# EasyEDA Pro project KP1921VG015.epro

# Board PCB1
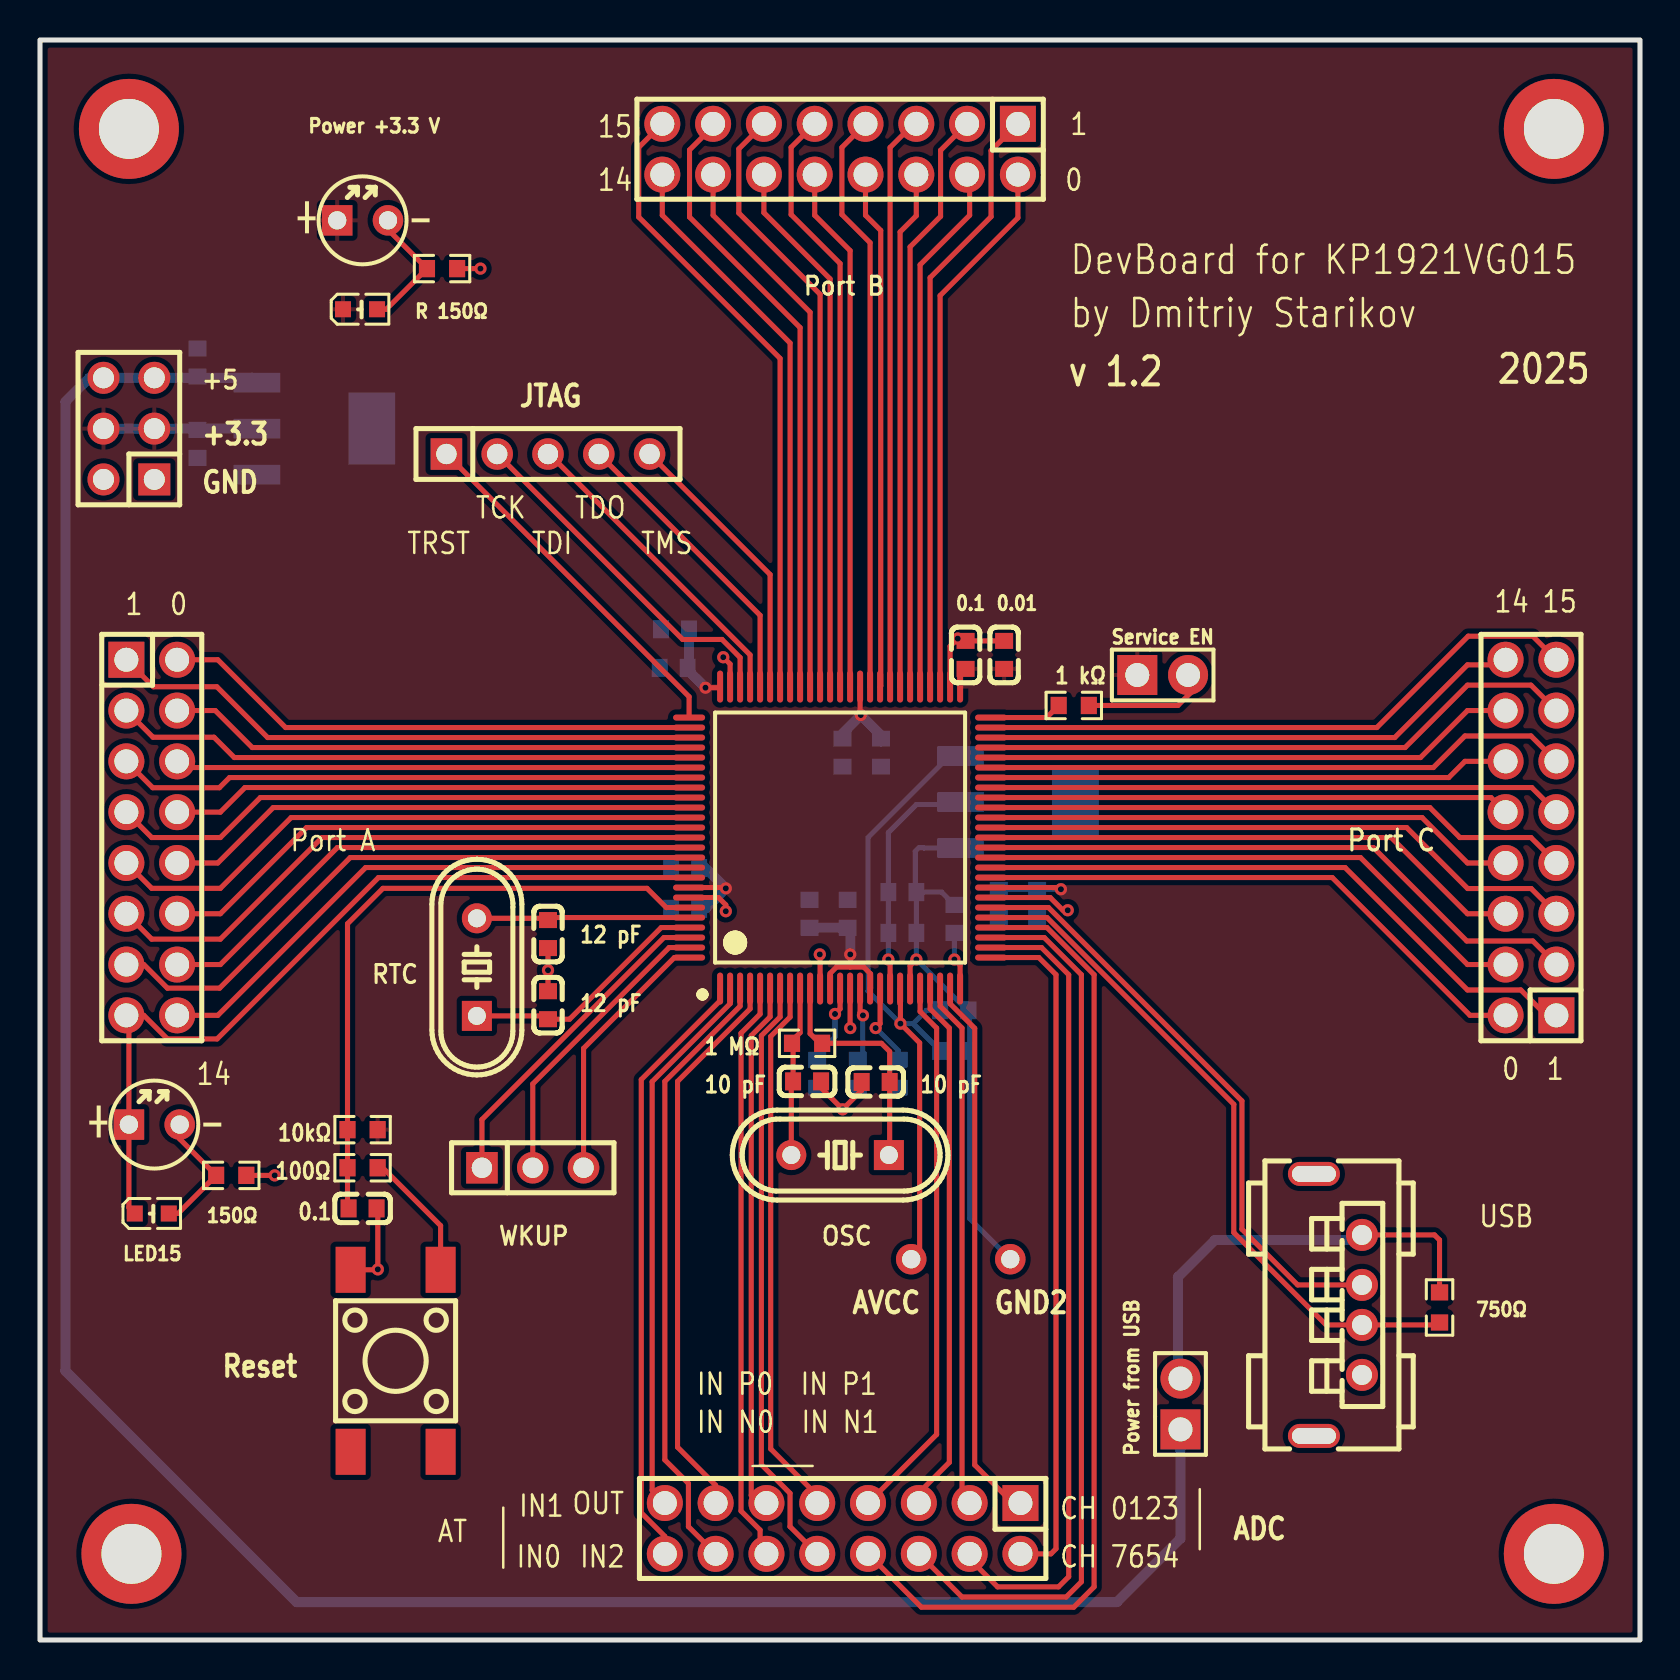
[diagram p0: board, top side]
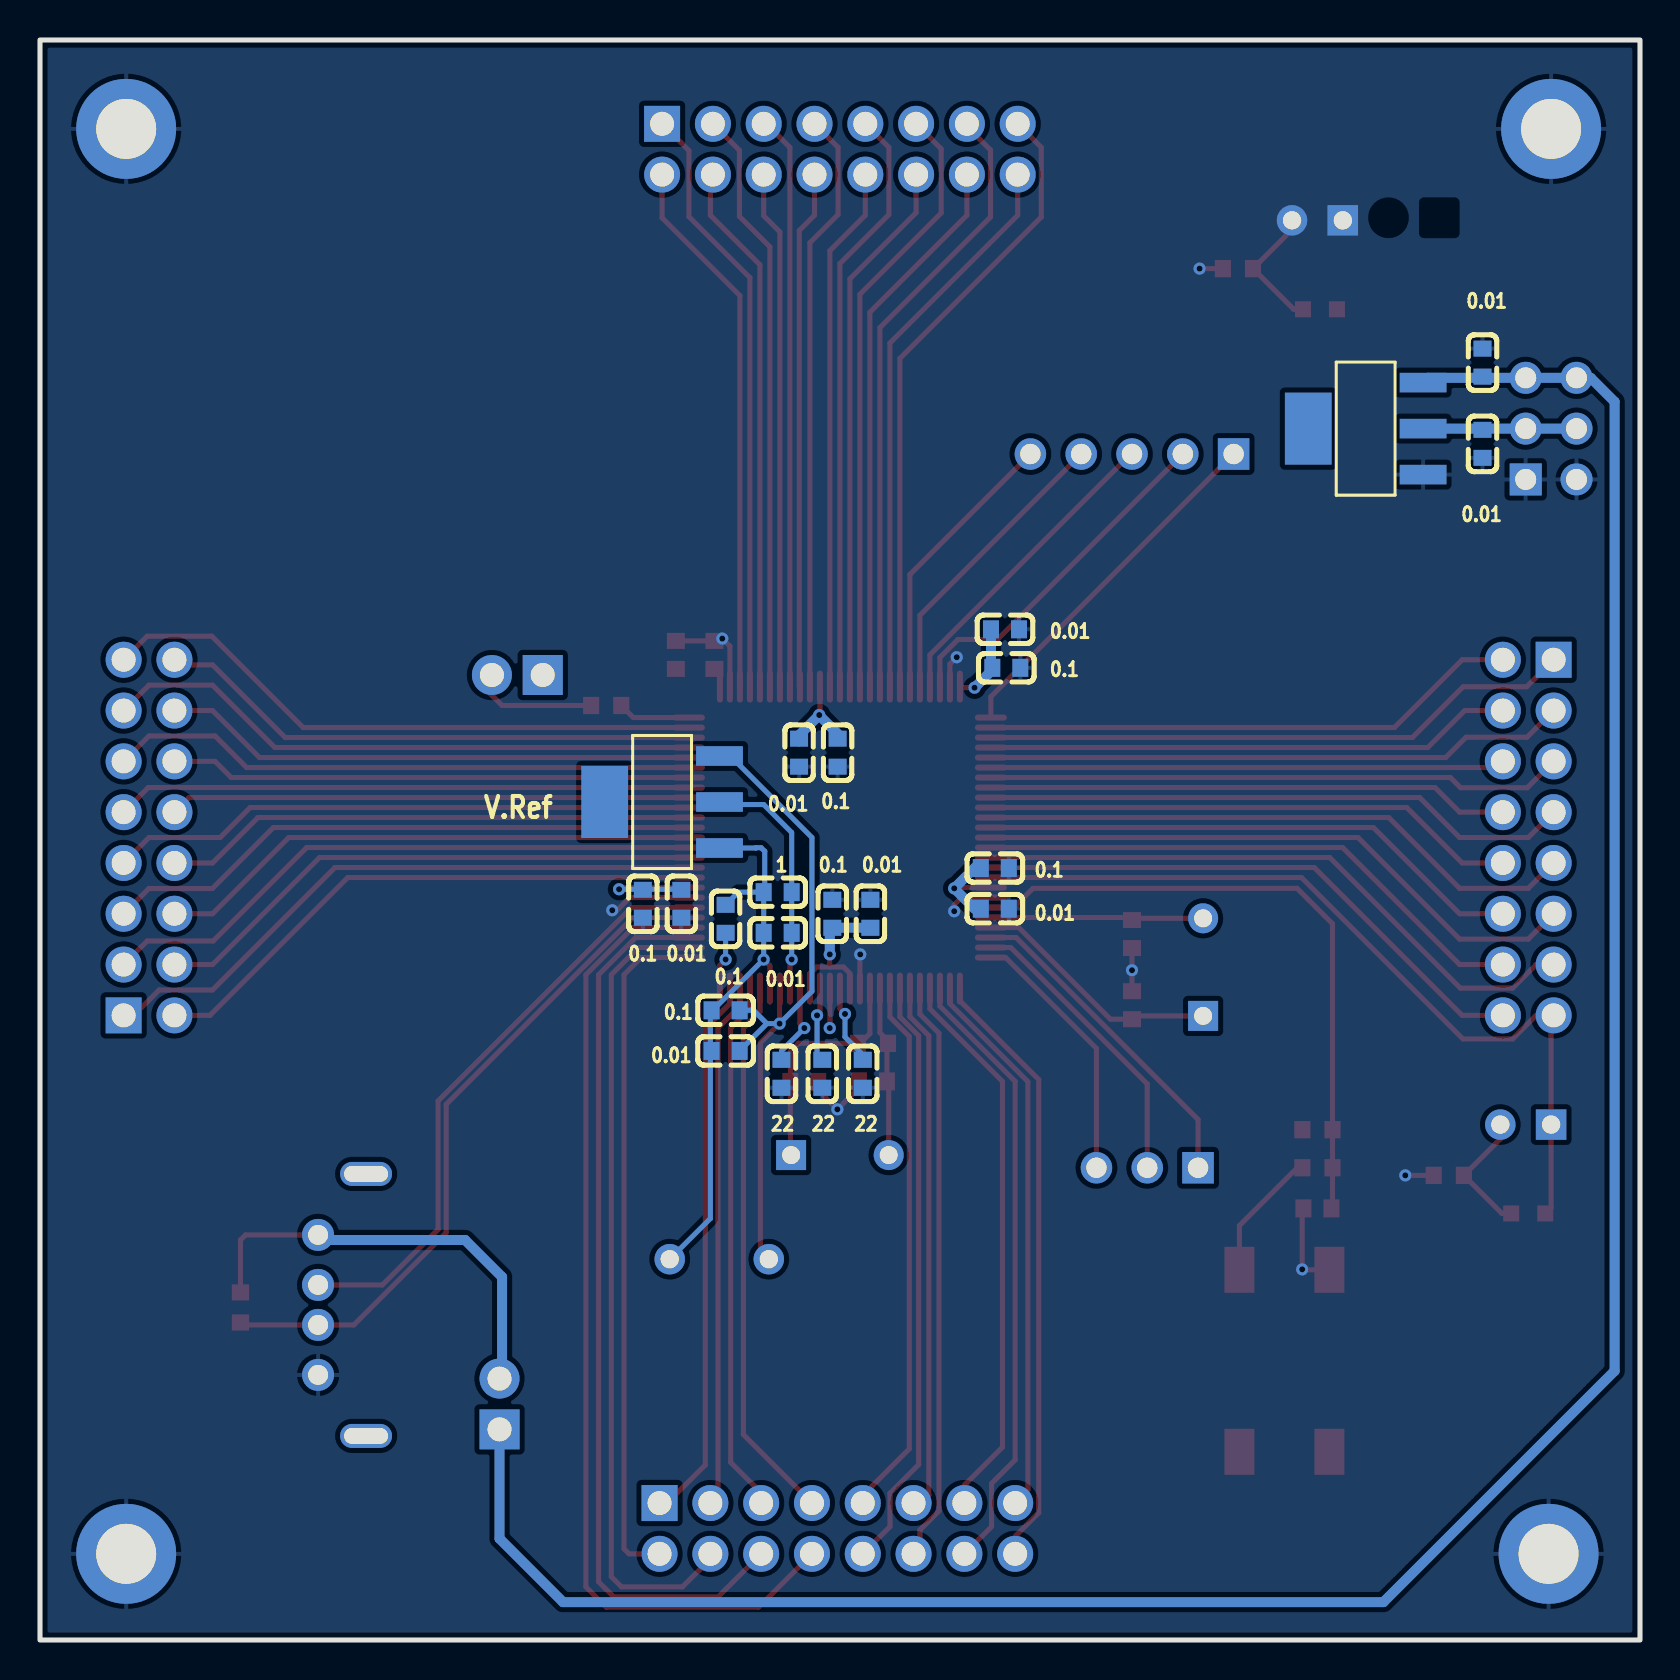
[diagram p1: board, bottom side, seen from below]

Outline 80 x 80 mm; copper layers: Top Layer, Bottom Layer. Coordinates in mm from the lower left corner of the outline.
Outline path: rectangle 0,80 80,0
Stack: Top Layer 0.035mm / Dielectric1 1.51mm FR4 er 4.5 / Bottom Layer 0.035mm

## Design rules (mm)
net USB_D+: DP1
net USB_D-: DP1
template: JLCPCB Capability(Two Layers Board)
spacing copperThickness1oz (default): track to track 0.102, other pairs 0.152 to 0.3
spacing copperThickness2oz: track to track 0.203, other pairs 0.152 to 0.3
track width copperThickness1oz (default): min 0.127, default 0.254, max 2.54
track width copperThickness2oz: min 0.203, default 0.254, max 2.54
differential pair differentialPair (default): width min 0.127, default 0.254, max 2.54; gap min 0.152, default 0.152
via viaSize (default): diameter min 0.5, default 0.61, max 10; hole min 0.3, default 0.305, max 6.3

## Placement (name value [footprint] x y rotation side)
150Ω  10K  [R0603]  9.56 23.23 0 top
 750Ω  10K  [R0603]  69.98 16.63 90 top
+5  -  [HDR-TH_6P-P2.54-V-R2-C3-S2.54_A2541WV-2X3P]  4.44 60.57 90 top
C1  100nF  [C0603]  38.86 28.31 90 bottom
C2  100nF  [C0603]  40.89 28.31 90 bottom
C3  100nF  [C0603]  42.93 28.31 90 bottom
C4  100nF  [C0603]  45.72 36.06 270 bottom
C5  -  [C0603]  46.28 49.26 270 top
C5#2  -  [C0603]  38.48 36.31 270 bottom
C5#3  -  [C0603]  49.86 36.81 90 bottom
C5#4  -  [C0603]  42.05 44.37 90 bottom
C5#5  -  [C0603]  31.75 50.54 0 bottom
C5#6  -  [C0603]  32.26 38.6 0 bottom
C6  -  [C0603]  48.21 49.26 270 top
C6#2  -  [C0603]  40.39 36.31 270 bottom
C6#3  -  [C0603]  47.93 36.81 90 bottom
C6#4  -  [C0603]  40.12 44.37 90 bottom
C6#5  -  [C0603]  31.69 48.61 0 bottom
C6#6  -  [C0603]  32.26 36.57 0 bottom
C7  100nF  [C0603]  7.87 63.87 90 bottom
C8  100nF  [C0603]  7.87 59.81 270 bottom
C9  100nF  [C0603]  16.13 21.58 0 top
C10  100nF  [C0603]  41.78 27.9 0 top
C11  100nF  [C0603]  38.35 27.93 180 top
C12  100nF  [C0603]  25.4 31.74 270 top
C13  100nF  [C0603]  25.4 35.3 90 top
C14  -  [C0603]  43.12 35.36 180 bottom
C14#2  -  [C0603]  45.72 29.45 180 bottom
C15  -  [C0603]  43.12 37.39 180 bottom
C15#2  -  [C0603]  45.72 31.49 180 bottom
H5  PZ254V-12-16P  [HDR-TH_16P-P2.54-V-M-R2-C8-S2.54]  40.13 5.58 180 top
H8  -  [HDR-TH_5P-P2.54-V-F]  25.4 59.3 0 top
LED15  TJ-L3FYTGHRMFCLFLC2R-A5  [LED-TH_BD3.9-P2.54-FD]  5.71 25.77 0 top
NOREF  -  [Pad_e4]  75.69 75.56 0 top
NOREF#2  -  [Pad_e2714]  43.56 19.04 0 top
NOREF#3  -  [Pad_e36]  4.57 4.31 0 top
NOREF#4  -  [Pad_e3375]  48.51 19.04 0 top
NOREF#5  -  [Pad_e37]  4.44 75.56 0 top
NOREF#6  -  [Pad_e33]  75.69 4.31 0 top
NOREF#7  -  [LED0603-R-RD]  5.59 21.33 0 top
NOREF#8  -  [LED0603-R-RD]  16 66.54 0 top
OSC  4MHz  [HC-49US_L11.5-W4.5-P4.88]  40 24.25 180 top
Port A  PZ254V-12-16P  [HDR-TH_16P-P2.54-V-M-R2-C8-S2.54]  5.59 40.12 270 top
Port B  PZ254V-12-16P  [HDR-TH_16P-P2.54-V-M-R2-C8-S2.54]  40 74.54 180 top
Port C  PZ254V-12-16P  [HDR-TH_16P-P2.54-V-M-R2-C8-S2.54]  74.55 40.12 90 top
Power +3.3 V  TJ-L3FYTGHRMFCLFLC2R-A5  [LED-TH_BD3.9-P2.54-FD]  16.13 70.98 0 top
Power from USB  PZ254V-11-02P  [HDR-TH_2P-P2.54-V-M]  57.02 11.8 90 top
R1  10K  [R0603]  51.69 46.73 0 top
R2  10K  [R0603]  16.13 23.61 180 top
R3  10K  [R0603]  16.13 25.52 0 top
R4  10K  [R0603]  38.35 29.84 180 top
R 150Ω  10K  [R0603]  20.1 68.57 0 top
Reset  -  [SW-SMD_4P-L6.0-W6.0-P4.50-LS9.0-2]  17.78 13.96 270 top
RTC  4MHz  [HC-49US_L11.5-W4.5-P4.88]  21.84 33.65 90 top
Service EN  PZ254V-11-02P  [HDR-TH_2P-P2.54-V-M]  56.13 48.25 0 top
USB1  AF 180°ZJB13.7  [USB-A-TH_AF-ZJB13.7]  64.9 16.75 270 top
V ADC  AMS1117-3.3  [SOT-223-3_L6.7-W3.7-P2.30-LS7.0-BR]  48.89 41.9 180 bottom
VIN  AMS1117-3.3  [SOT-223-3_L6.7-W3.7-P2.30-LS7.0-BR]  13.72 60.57 180 bottom
WKUP  -  [HDR-TH_3P-P2.54-V-F]  24.64 23.61 0 top
КР1921ВГ015  STM32L4A6VGT6  [LQFP-100_L14.0-W14.0-P0.50-LS16.0-BL]  40 40.12 0 top

## Footprints (pads in the part's own frame, mm; a bottom-side part is the same pattern mirrored in y, then rotated)
C0603
  rect 0.8x0.9 smd: 1(-0.7,0) 2(0.7,0)
HC-49US_L11.5-W4.5-P4.88
  rect 1.5x1.5 hole 0.9: 1(-2.44,0)
  round 1.5 hole 0.9: 2(2.44,0)
HDR-TH_2P-P2.54-V-M
  rect 2x2 hole 1.2: 1(-1.27,0)
  round 2 hole 1.2: 2(1.27,0)
HDR-TH_3P-P2.54-V-F
  rect 1.575x1.575 hole 1.02: 1(-2.54,0)
  round 1.575 hole 1.02: 2(0,0) 3(2.54,0)
HDR-TH_5P-P2.54-V-F
  rect 1.575x1.575 hole 1.02: 1(-5.08,0)
  round 1.575 hole 1.02: 2(-2.54,0) 3(0,0) 4(2.54,0) 5(5.08,0)
HDR-TH_6P-P2.54-V-R2-C3-S2.54_A2541WV-2X3P
  rect 1.6x1.6 hole 1.05: 1(-2.54,-1.27)
  round 1.6 hole 1.05: 2(-2.54,1.27) 3(0,-1.27) 4(0,1.27) 5(2.54,-1.27) 6(2.54,1.27)
HDR-TH_16P-P2.54-V-M-R2-C8-S2.54
  rect 1.8x1.8 hole 1.2: 1(-8.89,-1.27)
  round 1.8 hole 1.2: 2(-8.89,1.27) 3(-6.35,-1.27) 4(-6.35,1.27) 5(-3.81,-1.27) 6(-3.81,1.27) 7(-1.27,-1.27) 8(-1.27,1.27) 9(1.27,-1.27) 10(1.27,1.27) 11(3.81,-1.27) 12(3.81,1.27) 13(6.35,-1.27) 14(6.35,1.27) 15(8.89,-1.27) 16(8.89,1.27)
LED0603-R-RD
  rect 0.8x0.8 smd: 1(0.851,0) 2(-0.851,0)
LED-TH_BD3.9-P2.54-FD
  rect 1.524x1.524 hole 0.914: 1(-1.27,0)
  round 1.524 hole 0.914: 2(1.27,0)
LQFP-100_L14.0-W14.0-P0.50-LS16.0-BL
  oval 0.3x1.6 smd: 1(-6,-7.55) 2(-5.5,-7.55) 3(-5,-7.55) 4(-4.5,-7.55) 5(-4,-7.55) 6(-3.5,-7.55) 7(-3,-7.55) 8(-2.5,-7.55) 9(-2,-7.55) 10(-1.5,-7.55) 11(-1,-7.55) 12(-0.5,-7.55) 13(0,-7.55) 14(0.5,-7.55) 15(1,-7.55) 16(1.5,-7.55) 17(2,-7.55) 18(2.5,-7.55) 19(3,-7.55) 20(3.5,-7.55) 21(4,-7.55) 22(4.5,-7.55) 23(5,-7.55) 24(5.5,-7.55) 25(6,-7.55) 51(6,7.55) 52(5.5,7.55) 53(5,7.55) 54(4.5,7.55) 55(4,7.55) 56(3.5,7.55) 57(3,7.55) 58(2.5,7.55) 59(2,7.55) 60(1.5,7.55) 61(1,7.55) 62(0.5,7.55) 63(0,7.55) 64(-0.5,7.55) 65(-1,7.55) 66(-1.5,7.55) 67(-2,7.55) 68(-2.5,7.55) 69(-3,7.55) 70(-3.5,7.55) 71(-4,7.55) 72(-4.5,7.55) 73(-5,7.55) 74(-5.5,7.55) 75(-6,7.55)
  oval 1.6x0.3 smd: 26(7.55,-6) 27(7.55,-5.5) 28(7.55,-5) 29(7.55,-4.5) 30(7.55,-4) 31(7.55,-3.5) 32(7.55,-3) 33(7.55,-2.5) 34(7.55,-2) 35(7.55,-1.5) 36(7.55,-1) 37(7.55,-0.5) 38(7.55,0) 39(7.55,0.5) 40(7.55,1) 41(7.55,1.5) 42(7.55,2) 43(7.55,2.5) 44(7.55,3) 45(7.55,3.5) 46(7.55,4) 47(7.55,4.5) 48(7.55,5) 49(7.55,5.5) 50(7.55,6) 76(-7.55,6) 77(-7.55,5.5) 78(-7.55,5) 79(-7.55,4.5) 80(-7.55,4) 81(-7.55,3.5) 82(-7.55,3) 83(-7.55,2.5) 84(-7.55,2) 85(-7.55,1.5) 86(-7.55,1) 87(-7.55,0.5) 88(-7.55,0) 89(-7.55,-0.5) 90(-7.55,-1) 91(-7.55,-1.5) 92(-7.55,-2) 93(-7.55,-2.5) 94(-7.55,-3) 95(-7.55,-3.5) 96(-7.55,-4) 97(-7.55,-4.5) 98(-7.55,-5) 99(-7.55,-5.5) 100(-7.55,-6)
Pad_e4
  round 5 hole 3: 1(0,0)
Pad_e33
  round 5 hole 3: 1(0,0)
Pad_e36
  round 5 hole 3: 1(0,0)
Pad_e37
  round 5 hole 3: 1(0,0)
Pad_e2714
  round 1.524 hole 0.914: 1(0,0)
Pad_e3375
  round 1.524 hole 0.914: 1(0,0)
R0603
  rect 0.806x0.864 smd: 1(-0.753,0) 2(0.753,0)
SOT-223-3_L6.7-W3.7-P2.30-LS7.0-BR
  rect 2.34x0.98 smd: 1(2.87,-2.3) 2(2.87,0) 3(2.87,2.3)
  rect 2.34x3.6 smd: 4(-2.87,0)
SW-SMD_4P-L6.0-W6.0-P4.50-LS9.0-2
  rect 2.3x1.5 smd: 1(-4.55,2.25) 2(4.55,2.25) 3(-4.55,-2.25) 4(4.55,-2.25)
USB-A-TH_AF-ZJB13.7
  round 1.6 hole 1: 1(-3.5,1.2) 2(-1,1.2) 3(1,1.2) 4(3.5,1.2)
  oval 1.2x2.6 hole 0.8x2.2: 5(-6.55,-1.2) 5(6.55,-1.2)

## Nets
GND1: 150Ω.2 +5.1 +5.2 C1.1 C2.1 C3.1 C5.1 C5#2.1 C5#3.1 C5#4.1 C5#5.1 C5#6.1 C6.1 C6#2.1 C6#3.1 C6#4.1 C6#5.1 C6#6.1 C7.2 C8.2 C9.2 C10.1 C11.1 C12.1 C13.1 NOREF.1 NOREF#3.1 NOREF#5.1 NOREF#6.1 R 150Ω.2 Reset.3 USB1.4 VIN.1 КР1921ВГ015.11 КР1921ВГ015.32 КР1921ВГ015.52 КР1921ВГ015.74 КР1921ВГ015.94
GND2: C4.1 C14.1 C14#2.1 C15.1 C15#2.1 NOREF#4.1 V ADC.1 КР1921ВГ015.20
VCC1: +5.3 +5.4 C5.2 C5#2.2 C5#3.2 C5#4.2 C5#5.2 C5#6.2 C6.2 C6#2.2 C6#3.2 C6#4.2 C6#5.2 C6#6.2 C8.1 NOREF#8.2 Power +3.3 V.1 R3.2 Service EN.1 VIN.2 КР1921ВГ015.12 КР1921ВГ015.16 КР1921ВГ015.33 КР1921ВГ015.51 КР1921ВГ015.61 КР1921ВГ015.75 КР1921ВГ015.93
VCC2: C14#2.2 C15#2.2 NOREF#2.1 V ADC.3 КР1921ВГ015.19
VIN: +5.5 +5.6 C7.1 Power from USB.1 VIN.3
13: C1.2 КР1921ВГ015.13
15: C2.2 КР1921ВГ015.15
17: C3.2 КР1921ВГ015.17
$LED15_2: 150Ω.1 LED15.2 NOREF#7.1
$R1_2: R1.2 Service EN.2
$R2_1: R2.1 Reset.1
$R 150Ω_1: NOREF#8.1 Power +3.3 V.2 R 150Ω.1
ADC_CH0: H5.7 КР1921ВГ015.21
ADC_CH1: H5.5 КР1921ВГ015.22
ADC_CH2: H5.3 КР1921ВГ015.23
ADC_CH3: H5.1 КР1921ВГ015.24
ADC_CH4: H5.2 КР1921ВГ015.26
ADC_CH5: H5.4 КР1921ВГ015.27
ADC_CH6: H5.6 КР1921ВГ015.28
ADC_CH7: H5.8 КР1921ВГ015.29
AREF: C14.2 C15.2 V ADC.2 КР1921ВГ015.18
AT_IN0: H5.16 КР1921ВГ015.1
AT_IN1: H5.15 КР1921ВГ015.2
AT_IN2: H5.14 КР1921ВГ015.3
AT_OUT: H5.13 КР1921ВГ015.4
CNO_INN0: H5.12 КР1921ВГ015.5
CNO_INN1: H5.10 КР1921ВГ015.7
CNO_INP0: H5.11 КР1921ВГ015.6
CNO_INP1: H5.9 КР1921ВГ015.8
PA0: Port A.2 КР1921ВГ015.77
PA1: Port A.1 КР1921ВГ015.78
PA2: Port A.4 КР1921ВГ015.79
PA3: Port A.3 КР1921ВГ015.80
PA4: Port A.6 КР1921ВГ015.81
PA5: Port A.5 КР1921ВГ015.82
PA6: Port A.8 КР1921ВГ015.83
PA7: Port A.7 КР1921ВГ015.84
PA8: Port A.10 КР1921ВГ015.85
PA9: Port A.9 КР1921ВГ015.86
PA10: Port A.12 КР1921ВГ015.87
PA11: Port A.11 КР1921ВГ015.88
PA12: Port A.14 КР1921ВГ015.89
PA13: Port A.13 КР1921ВГ015.90
PA14: Port A.16 КР1921ВГ015.91
PA15: LED15.1 NOREF#7.2 Port A.15 КР1921ВГ015.92
PB0: Port B.2 КР1921ВГ015.53
PB1: Port B.1 КР1921ВГ015.54
PB2: Port B.4 КР1921ВГ015.55
PB3: Port B.3 КР1921ВГ015.56
PB4: Port B.6 КР1921ВГ015.57
PB5: Port B.5 КР1921ВГ015.58
PB6: Port B.8 КР1921ВГ015.59
PB7: Port B.7 КР1921ВГ015.60
PB8: Port B.10 КР1921ВГ015.62
PB9: Port B.9 КР1921ВГ015.63
PB10: Port B.12 КР1921ВГ015.64
PB11: Port B.11 КР1921ВГ015.65
PB12: Port B.14 КР1921ВГ015.66
PB13: Port B.13 КР1921ВГ015.67
PB14: Port B.16 КР1921ВГ015.68
PB15: Port B.15 КР1921ВГ015.69
PC0: Port C.2 КР1921ВГ015.34
PC1: Port C.1 КР1921ВГ015.35
PC2: Port C.4 КР1921ВГ015.36
PC3: Port C.3 КР1921ВГ015.37
PC4: Port C.6 КР1921ВГ015.38
PC5: Port C.5 КР1921ВГ015.39
PC6: Port C.8 КР1921ВГ015.40
PC7: Port C.7 КР1921ВГ015.41
PC8: Port C.10 КР1921ВГ015.42
PC9: Port C.9 КР1921ВГ015.43
PC10: Port C.12 КР1921ВГ015.44
PC11: Port C.11 КР1921ВГ015.45
PC12: Port C.14 КР1921ВГ015.46
PC13: Port C.13 КР1921ВГ015.47
PC14: Port C.16 КР1921ВГ015.48
PC15: Port C.15 КР1921ВГ015.49
RST: C9.1 R2.2 R3.1 КР1921ВГ015.95
SDADC_CAP: C4.2 КР1921ВГ015.25
SERV_EN: R1.1 КР1921ВГ015.50
TCK: H8.2 КР1921ВГ015.73
TDI: H8.3 КР1921ВГ015.72
TDO: H8.4 КР1921ВГ015.71
TMS: H8.5 КР1921ВГ015.70
TRST: H8.1 КР1921ВГ015.76
USB_D+:  750Ω.1 USB1.3 КР1921ВГ015.30
USB_D-: USB1.2 КР1921ВГ015.31
V_BAT: КР1921ВГ015.14
VUSB:  750Ω.2 Power from USB.2 USB1.1
WKUP0: WKUP.3 КР1921ВГ015.100
WKUP1: WKUP.2 КР1921ВГ015.99
WKUP2: WKUP.1 КР1921ВГ015.98
XI_OSC: C11.2 OSC.2 R4.2 КР1921ВГ015.9
XI_RTC: C12.2 RTC.1 КР1921ВГ015.97
XO_OSC: C10.2 OSC.1 R4.1 КР1921ВГ015.10
XO_RTC: C13.2 RTC.2 КР1921ВГ015.96

Pads without a net: Reset 2 4; USB1 5; V ADC 4; VIN 4

## Via types
v1: diameter 0.61, hole 0.305, Top Layer to Bottom Layer, 23 vias

## Routing (per net, layer and track width the routed paths; a pad name or vN(x,y) marks a point on that pad's centre or on a via; arc(x,y) is an arc through that point)
GND1: length 27
  Top Layer w0.254: C9.2 16.89,21.52 v1(16.89,18.53) 16.87,18.51 Reset.3 ; v1(34.16,49.14) 34.5,48.8 КР1921ВГ015.74 ; 150Ω.2 v1(11.73,23.23) ; v1(51.39,36.49) 51.15,36.49 50.51,37.12 КР1921ВГ015.32 ; КР1921ВГ015.52 45.5,49.69 v1(45.89,50.07) ; C13.1 25.4,33.49 ; v1(34.29,36.44) 34.29,36.76 33.92,37.12 КР1921ВГ015.94 ; C6.1 C5.1 ; КР1921ВГ015.11 39,34.26 v1(38.99,34.28) ; C11.1 39.05,27.61 v1(40.13,26.53) 41.08,27.48 C10.1 ; C12.1 v1(25.4,33.49) ; 20.86,68.57 v1(22.02,68.57)
GND2: length 28.5
  Top Layer w0.254: v1(43.82,34.03) 43.5,33.71 КР1921ВГ015.20
  Bottom Layer w0.254: C15.1 C14.1 43.82,34.03 v1(43.82,34.03) 46.48,31.36 46.48,21.07 NOREF#4.1 ; C15.1 45.09,37.39 C4.1 ; C15.1 43.76,37.45 43.76,39.43 43.94,39.61 44.2,39.61 44.21,39.6 V ADC.1
VCC1: length 35.8
  Top Layer w0.254: v1(41.04,46.25) 41,46.28 КР1921ВГ015.61 ; КР1921ВГ015.12 39.5,33.33 39.83,33.65 40.51,33.65 ; 40.51,33.65 40.51,33.66 v1(40.51,34.28) ; 40.51,33.65 41.18,33.65 41.53,33.31 41.53,32.6 КР1921ВГ015.16 ; v1(33.27,47.62) 33.95,47.62 КР1921ВГ015.75 ; КР1921ВГ015.93 34.25,37.62 v1(34.29,37.58) ; КР1921ВГ015.33 50.96,37.62 v1(51.05,37.54)
  Bottom Layer w0.254: C6#3.2 47.96,37.54 v1(51.05,37.54)
  Bottom Layer w0.5: C5#2.2 C6#2.2 40.51,35.49 v1(40.51,34.28) ; VIN.2 +5.3 +5.4 ; v1(33.27,47.62) 32.38,48.5 C6#5.2 32.45,48.67 C5#5.2 ; 40.13,45.33 41.04,46.24 v1(41.04,46.25) 42.05,45.24 42.05,44.94 ; C6#6.2 33.27,36.57 v1(34.29,37.58) 33.15,38.73
VCC2: length 35
  Top Layer w0.254: КР1921ВГ015.19 43,31.82 43.02,31.8 v1(43.02,30.82) 43.98,29.86 43.98,19.46 43.5,18.98 ; 43.5,18.98 43.56,18.91 43.43,18.91 43.5,18.98
  Bottom Layer w0.254: 43.66,30.82 v1(43.02,30.82) 41.4,32.44 41.4,40.12 45.48,44.2 V ADC.3 ; 43.66,30.82 44.32,31.49 C15#2.2 ; 43.66,30.82 C14#2.2
VIN: length 125.9
  Bottom Layer w0.5: Power from USB.1 57.02,5.07 53.85,1.9 12.83,1.9 1.27,13.45 1.27,61.91 2.47,63.11 +5.6 +5.5 10.61,63.11 VIN.3
13: length 4.1
  Top Layer w0.254: v1(39.75,31.3) 40,31.56 КР1921ВГ015.13
  Bottom Layer w0.254: 38.61,29.01 39.75,30.15 v1(39.75,31.3)
15: length 3.7
  Top Layer w0.254: v1(41.15,31.23) 41,31.38 КР1921ВГ015.15
  Bottom Layer w0.254: C2.2 41.15,29.27 v1(41.15,31.23)
17: length 4.1
  Top Layer w0.254: v1(41.78,30.6) 42,30.82 КР1921ВГ015.17
  Bottom Layer w0.254: v1(41.78,30.6) 42.93,29.45 C3.2
$LED15_2: length 6.5
  Top Layer w0.254: NOREF#7.1 6.9,21.33 150Ω.1 6.98,25.05 LED15.2
$R1_2: length 6.3
  Top Layer w0.254: Service EN.2 57.53,48.12 57.53,47.36 56.9,46.73 R1.2
$R2_1: length 6.3
  Top Layer w0.254: 17.14,23.61 20.03,20.72 Reset.1
$R 150Ω_1: length 6.6
  Top Layer w0.254: Power +3.3 V.2 17.4,70.52 R 150Ω.1 17.32,66.54 NOREF#8.1
ADC_CH0: length 27.5
  Top Layer w0.254: КР1921ВГ015.21 44,31.42 44.83,30.6 44.83,10.28 41.4,6.85
ADC_CH1: length 26.8
  Top Layer w0.254: КР1921ВГ015.22 44.5,31.56 45.47,30.6 45.47,8.88 43.94,7.36 H5.5
ADC_CH2: length 26.3
  Top Layer w0.254: H5.3 46.1,7.23 46.1,30.6 45,31.69 КР1921ВГ015.23
ADC_CH3: length 27.4
  Top Layer w0.254: H5.1 48.64,6.85 46.74,8.75 46.74,30.58 45.5,31.82 КР1921ВГ015.24
ADC_CH4: length 34.2
  Top Layer w0.254: H5.2 50.55,4.31 50.8,4.56 50.8,33.26 49.94,34.12 КР1921ВГ015.26
ADC_CH5: length 40.5
  Top Layer w0.254: КР1921ВГ015.27 50.08,34.62 51.44,33.26 51.44,3.17 50.93,2.66 47.88,2.66 46.48,4.05 H5.4
ADC_CH6: length 45
  Top Layer w0.254: H5.6 46.1,2.15 51.31,2.15 52.07,2.91 52.07,33.26 50.21,35.12 КР1921ВГ015.28
ADC_CH7: length 49.6
  Top Layer w0.254: 41.4,4.31 44.07,1.64 51.69,1.64 52.7,2.66 52.7,33.26 50.35,35.62 КР1921ВГ015.29
AREF: length 12.1
  Top Layer w0.254: КР1921ВГ015.18 42.5,33.94 v1(42.42,34.03)
  Bottom Layer w0.254: 42.42,34.03 C14.2 C15.2 42.42,40.37 43.81,41.77 45.9,41.77 V ADC.2
AT_IN0: length 30.4
  Top Layer w0.254: 31.24,4.31 31.24,5.18 30.06,6.36 30.06,28.02 34,31.96 КР1921ВГ015.1
AT_IN1: length 27.6
  Top Layer w0.254: КР1921ВГ015.2 34.5,31.82 30.61,27.92 30.61,7.48 31.24,6.85
AT_IN2: length 30.9
  Top Layer w0.254: 33.78,4.31 32.42,5.67 32.42,7.83 31.24,9.01 31.24,27.93 35,31.69 КР1921ВГ015.3
AT_OUT: length 28
  Top Layer w0.254: КР1921ВГ015.4 35.5,31.56 31.88,27.93 31.88,9.64 33.78,7.74 33.78,6.85
CNO_INN0: length 29.2
  Top Layer w0.254: H5.12 36,4.62 36,5.5 35.05,6.45 35.05,30.34 36,31.3 КР1921ВГ015.5
CNO_INN1: length 29.8
  Top Layer w0.254: H5.10 37.5,5.67 37.5,7.34 36.07,8.77 36.07,30.22 37,31.15 КР1921ВГ015.7
CNO_INP0: length 26.7
  Top Layer w0.254: H5.11 35.94,6.85 35.56,7.23 35.56,30.22 36.5,31.16 КР1921ВГ015.6
CNO_INP1: length 27.1
  Top Layer w0.254: H5.9 38.86,7.23 36.54,9.56 36.54,30.18 37.5,31.15 КР1921ВГ015.8
PA0: length 27
  Top Layer w0.254: КР1921ВГ015.77 12.28,45.62 8.89,49.01 Port A.2
PA1: length 29.7
  Top Layer w0.254: Port A.1 5.67,47.66 8.84,47.66 11.38,45.12 КР1921ВГ015.78
PA2: length 26.4
  Top Layer w0.254: Port A.4 8.76,46.47 10.61,44.62 КР1921ВГ015.79
PA3: length 29.1
  Top Layer w0.254: КР1921ВГ015.80 9.72,44.12 8.7,45.14 5.65,45.14 Port A.3
PA4: length 25.7
  Top Layer w0.254: КР1921ВГ015.81 7.17,43.62 Port A.6
PA5: length 28.9
  Top Layer w0.254: Port A.5 5.64,42.61 8.97,42.61 9.48,43.12 КР1921ВГ015.82
PA6: length 26.1
  Top Layer w0.254: КР1921ВГ015.83 10.25,42.62 9.02,41.39 Port A.8
PA7: length 29.5
  Top Layer w0.254: КР1921ВГ015.84 11.02,42.12 9.02,40.12 5.59,40.12 Port A.7
PA8: length 26.7
  Top Layer w0.254: КР1921ВГ015.85 11.66,41.62 8.89,38.85 Port A.10
PA9: length 30.1
  Top Layer w0.254: КР1921ВГ015.86 12.56,41.12 9.02,37.58 5.59,37.58 Port A.9
PA10: length 27.4
  Top Layer w0.254: КР1921ВГ015.87 13.33,40.62 9.02,36.31 Port A.12
PA11: length 30.8
  Top Layer w0.254: КР1921ВГ015.88 14.1,40.12 9.02,35.04 5.59,35.04 Port A.11
PA12: length 28
  Top Layer w0.254: КР1921ВГ015.89 14.87,39.62 9.02,33.77 Port A.14
PA13: length 31.3
  Top Layer w0.254: Port A.13 5.19,33.77 6.37,32.59 8.98,32.59 15.51,39.12 КР1921ВГ015.90
PA14: length 28.7
  Top Layer w0.254: Port A.16 8.89,31.23 16.28,38.62 КР1921ВГ015.91
PA15: length 42
  Top Layer w0.254: КР1921ВГ015.92 16.92,38.12 8.85,30.05 6.37,30.05 5.19,31.23 Port A.15 4.44,31.11 LED15.1 4.44,21.62 NOREF#7.2
PB0: length 27.2
  Top Layer w0.254: Port B.2 48.89,71.11 45,67.22 КР1921ВГ015.53
PB1: length 30
  Top Layer w0.254: Port B.1 47.55,74.47 47.55,71.17 44.5,68.12 КР1921ВГ015.54
PB2: length 26.7
  Top Layer w0.254: Port B.4 46.48,73.14 46.48,71.24 44,68.76 КР1921ВГ015.55
PB3: length 29.3
  Top Layer w0.254: КР1921ВГ015.56 43.5,69.66 45.03,71.18 45.03,74.48 Port B.3
PB4: length 25.9
  Top Layer w0.254: Port B.6 43.81,71.21 43,70.4 КР1921ВГ015.57
PB5: length 28.8
  Top Layer w0.254: Port B.5 43.69,75.81 42.5,74.63 КР1921ВГ015.58
PB6: length 25.9
  Top Layer w0.254: Port B.8 41.28,71.24 42.04,70.48 42.04,47.7 КР1921ВГ015.59
PB7: length 29.2
  Top Layer w0.254: Port B.7 40.1,74.63 40.1,71.27 41.5,69.86 КР1921ВГ015.60
PB8: length 26.3
  Top Layer w0.254: Port B.10 38.73,71.24 40.5,69.47 КР1921ВГ015.62
PB9: length 29.6
  Top Layer w0.254: Port B.9 37.56,74.63 37.56,71.27 40,68.82 КР1921ВГ015.63
PB10: length 27
  Top Layer w0.254: Port B.12 36.19,71.36 39.5,68.05 КР1921ВГ015.64
PB11: length 30.3
  Top Layer w0.254: КР1921ВГ015.65 39,67.28 34.94,71.35 34.94,74.56 Port B.11
PB12: length 27.6
  Top Layer w0.254: Port B.14 33.66,71.24 38.5,66.39 КР1921ВГ015.66
PB13: length 30.9
  Top Layer w0.254: КР1921ВГ015.67 38,65.62 32.48,71.15 32.48,74.5 33.66,75.68 Port B.13
PB14: length 28.2
  Top Layer w0.254: Port B.16 31.12,71.24 37.5,64.85 КР1921ВГ015.68
PB15: length 31.6
  Top Layer w0.254: КР1921ВГ015.69 37,64.08 29.94,71.15 29.94,74.63 Port B.15
PC0: length 28.6
  Top Layer w0.254: Port C.2 71.5,31.23 64.61,38.12 КР1921ВГ015.34
PC1: length 31.3
  Top Layer w0.254: Port C.1 75.31,31.23 74.04,32.5 71.37,32.5 65.25,38.62 КР1921ВГ015.35
PC2: length 27.9
  Top Layer w0.254: Port C.4 71.37,33.77 66.02,39.12 КР1921ВГ015.36
PC3: length 30.7
  Top Layer w0.254: Port C.3 74.64,34.95 71.34,34.95 66.67,39.62 КР1921ВГ015.37
PC4: length 27.3
  Top Layer w0.254: Port C.6 71.37,36.31 67.56,40.12 КР1921ВГ015.38
PC5: length 30
  Top Layer w0.254: КР1921ВГ015.39 68.33,40.62 71.38,37.57 74.56,37.57 Port C.5
PC6: length 26.7
  Top Layer w0.254: Port C.8 71.37,38.85 69.1,41.12 КР1921ВГ015.40
PC7: length 29.4
  Top Layer w0.254: Port C.7 74.55,40.12 70.99,40.12 69.49,41.62 КР1921ВГ015.41
PC8: length 26
  Top Layer w0.254: Port C.10 72.55,42.12 КР1921ВГ015.42
PC9: length 28.8
  Top Layer w0.254: Port C.9 74.59,42.62 КР1921ВГ015.43
PC10: length 26.1
  Top Layer w0.254: КР1921ВГ015.44 70.44,43.12 71.25,43.93 Port C.12
PC11: length 29.4
  Top Layer w0.254: Port C.11 74.55,45.2 71.25,45.2 69.67,43.62 КР1921ВГ015.45
PC12: length 26.7
  Top Layer w0.254: КР1921ВГ015.46 69.02,44.12 71.37,46.47 Port C.14
PC13: length 30.1
  Top Layer w0.254: КР1921ВГ015.47 68.25,44.62 71.37,47.74 74.55,47.74 Port C.13
PC14: length 27.3
  Top Layer w0.254: Port C.16 73.03,48.76 71.37,48.76 67.74,45.12 КР1921ВГ015.48
PC15: length 30.6
  Top Layer w0.254: КР1921ВГ015.49 66.84,45.62 71.41,50.19 74.64,50.19 Port C.15
RST: length 32.6
  Top Layer w0.254: КР1921ВГ015.95 31.31,36.62 30.35,37.58 17.14,37.58 15.38,35.81 R3.1 R2.2 15.38,21.45
SDADC_CAP: length 2.9
  Top Layer w0.254: v1(45.72,34.03) 46,33.74 КР1921ВГ015.25
  Bottom Layer w0.254: v1(45.72,34.03) C4.2
SERV_EN: length 3.6
  Top Layer w0.254: КР1921ВГ015.50 50.33,46.12 R1.1
TCK: length 17.8
  Top Layer w0.254: КР1921ВГ015.73 35,49.12 34.1,50.03 32.13,50.03 H8.2
TDI: length 15.8
  Top Layer w0.254: КР1921ВГ015.72 35.5,49.25 25.59,59.17 25.53,59.17 H8.3
TDO: length 15
  Top Layer w0.254: КР1921ВГ015.71 36,51.23 H8.4
TMS: length 14.1
  Top Layer w0.254: КР1921ВГ015.70 36.5,53.27 H8.5
TRST: length 18.2
  Top Layer w0.254: H8.1 32.45,47.16 КР1921ВГ015.76
USB_D+: length 34.7
  Top Layer w0.254:  750Ω.1 69.86,15.75 USB1.3 64.31,15.75 59.69,20.37 59.69,26.78 50.35,36.12 КР1921ВГ015.30
USB_D-: length 30.1
  Top Layer w0.254: КР1921ВГ015.31 50.43,36.62 60.1,26.95 60.1,20.54 62.88,17.75 USB1.2
V_BAT: length 2
  Top Layer w0.254: КР1921ВГ015.14 40.5,30.61 v1(40.51,30.6)
VUSB: length 21.6
  Top Layer w0.254: USB1.1 69.72,20.25 69.98,20 69.98,17.59
  Bottom Layer w0.5: USB1.1 65.84,20 58.75,20 56.9,18.15 56.9,13.2 Power from USB.2
WKUP0: length 13.1
  Top Layer w0.254: WKUP.3 27.18,29.58 31.72,34.12 КР1921ВГ015.100
WKUP1: length 14.8
  Top Layer w0.254: КР1921ВГ015.99 31.46,34.62 24.64,27.8 WKUP.2
WKUP2: length 16.5
  Top Layer w0.254: КР1921ВГ015.98 31.19,35.12 22.1,26.03 22.1,23.61
XI_OSC: length 8.6
  Top Layer w0.254: КР1921ВГ015.9 38,30.37 37.6,29.96 37.65,29.91 C11.2 37.56,27.84 OSC.2
XI_RTC: length 12.6
  Top Layer w0.254: КР1921ВГ015.97 31.06,35.62 26.48,31.04 C12.2 25.23,31.21 RTC.1
XO_OSC: length 11.8
  Top Layer w0.254: OSC.1 42.48,24.29 C10.2 42.48,29.43 42.07,29.84 38.99,29.84 38.5,30.32 КР1921ВГ015.10
XO_RTC: length 10.7
  Top Layer w0.254: RTC.2 25.31,36.09 C13.2 25.53,36.12 КР1921ВГ015.96

## Copper pours and planes (outline as drawn; the poured copper is in the pictures)
GND1 on Bottom Layer: 0.38,79.62 79.63,79.62 79.63,0.37 0.38,0.37
VCC1 on Top Layer: 0.38,79.62 79.63,79.62 79.63,0.37 0.38,0.37

## Text on the board
Bottom Silkscreen Layer: 0.01 | 0.1 | 22 | 1 | V.Ref
Top Silkscreen Layer: 0.1 | 0.01 | 100Ω | 10kΩ | 12 pF | 1 MΩ | 10 pF | 1 kΩ | 1  0 | 14 | Port A | TRST | AT | TCK | IN0 | IN1 | TDI | OUT | TDO | IN2 | 15 | TMS | IN P0  IN P1 | IN N0  IN N1 | CH 0123 | CH 7654 | 0 | 1 | USB | 14 15 | 0  1 | Port C | +3.3 | GND | Reset | JTAG | AVCC | GND2 | ADC | DevBoard for KP1921VG015 | by Dmitriy Starikov | v 1.2 | 2025 | |
